# Altium schematic sheet arduino_nano.SchDoc
size 431 x 279 mm; SheetNumber: 2; SheetTotal: 4; ENG_APP_DATE: --/--/--; DSN_APP_DATE: --/--/--; CHK_APP_DATE: --/--/--
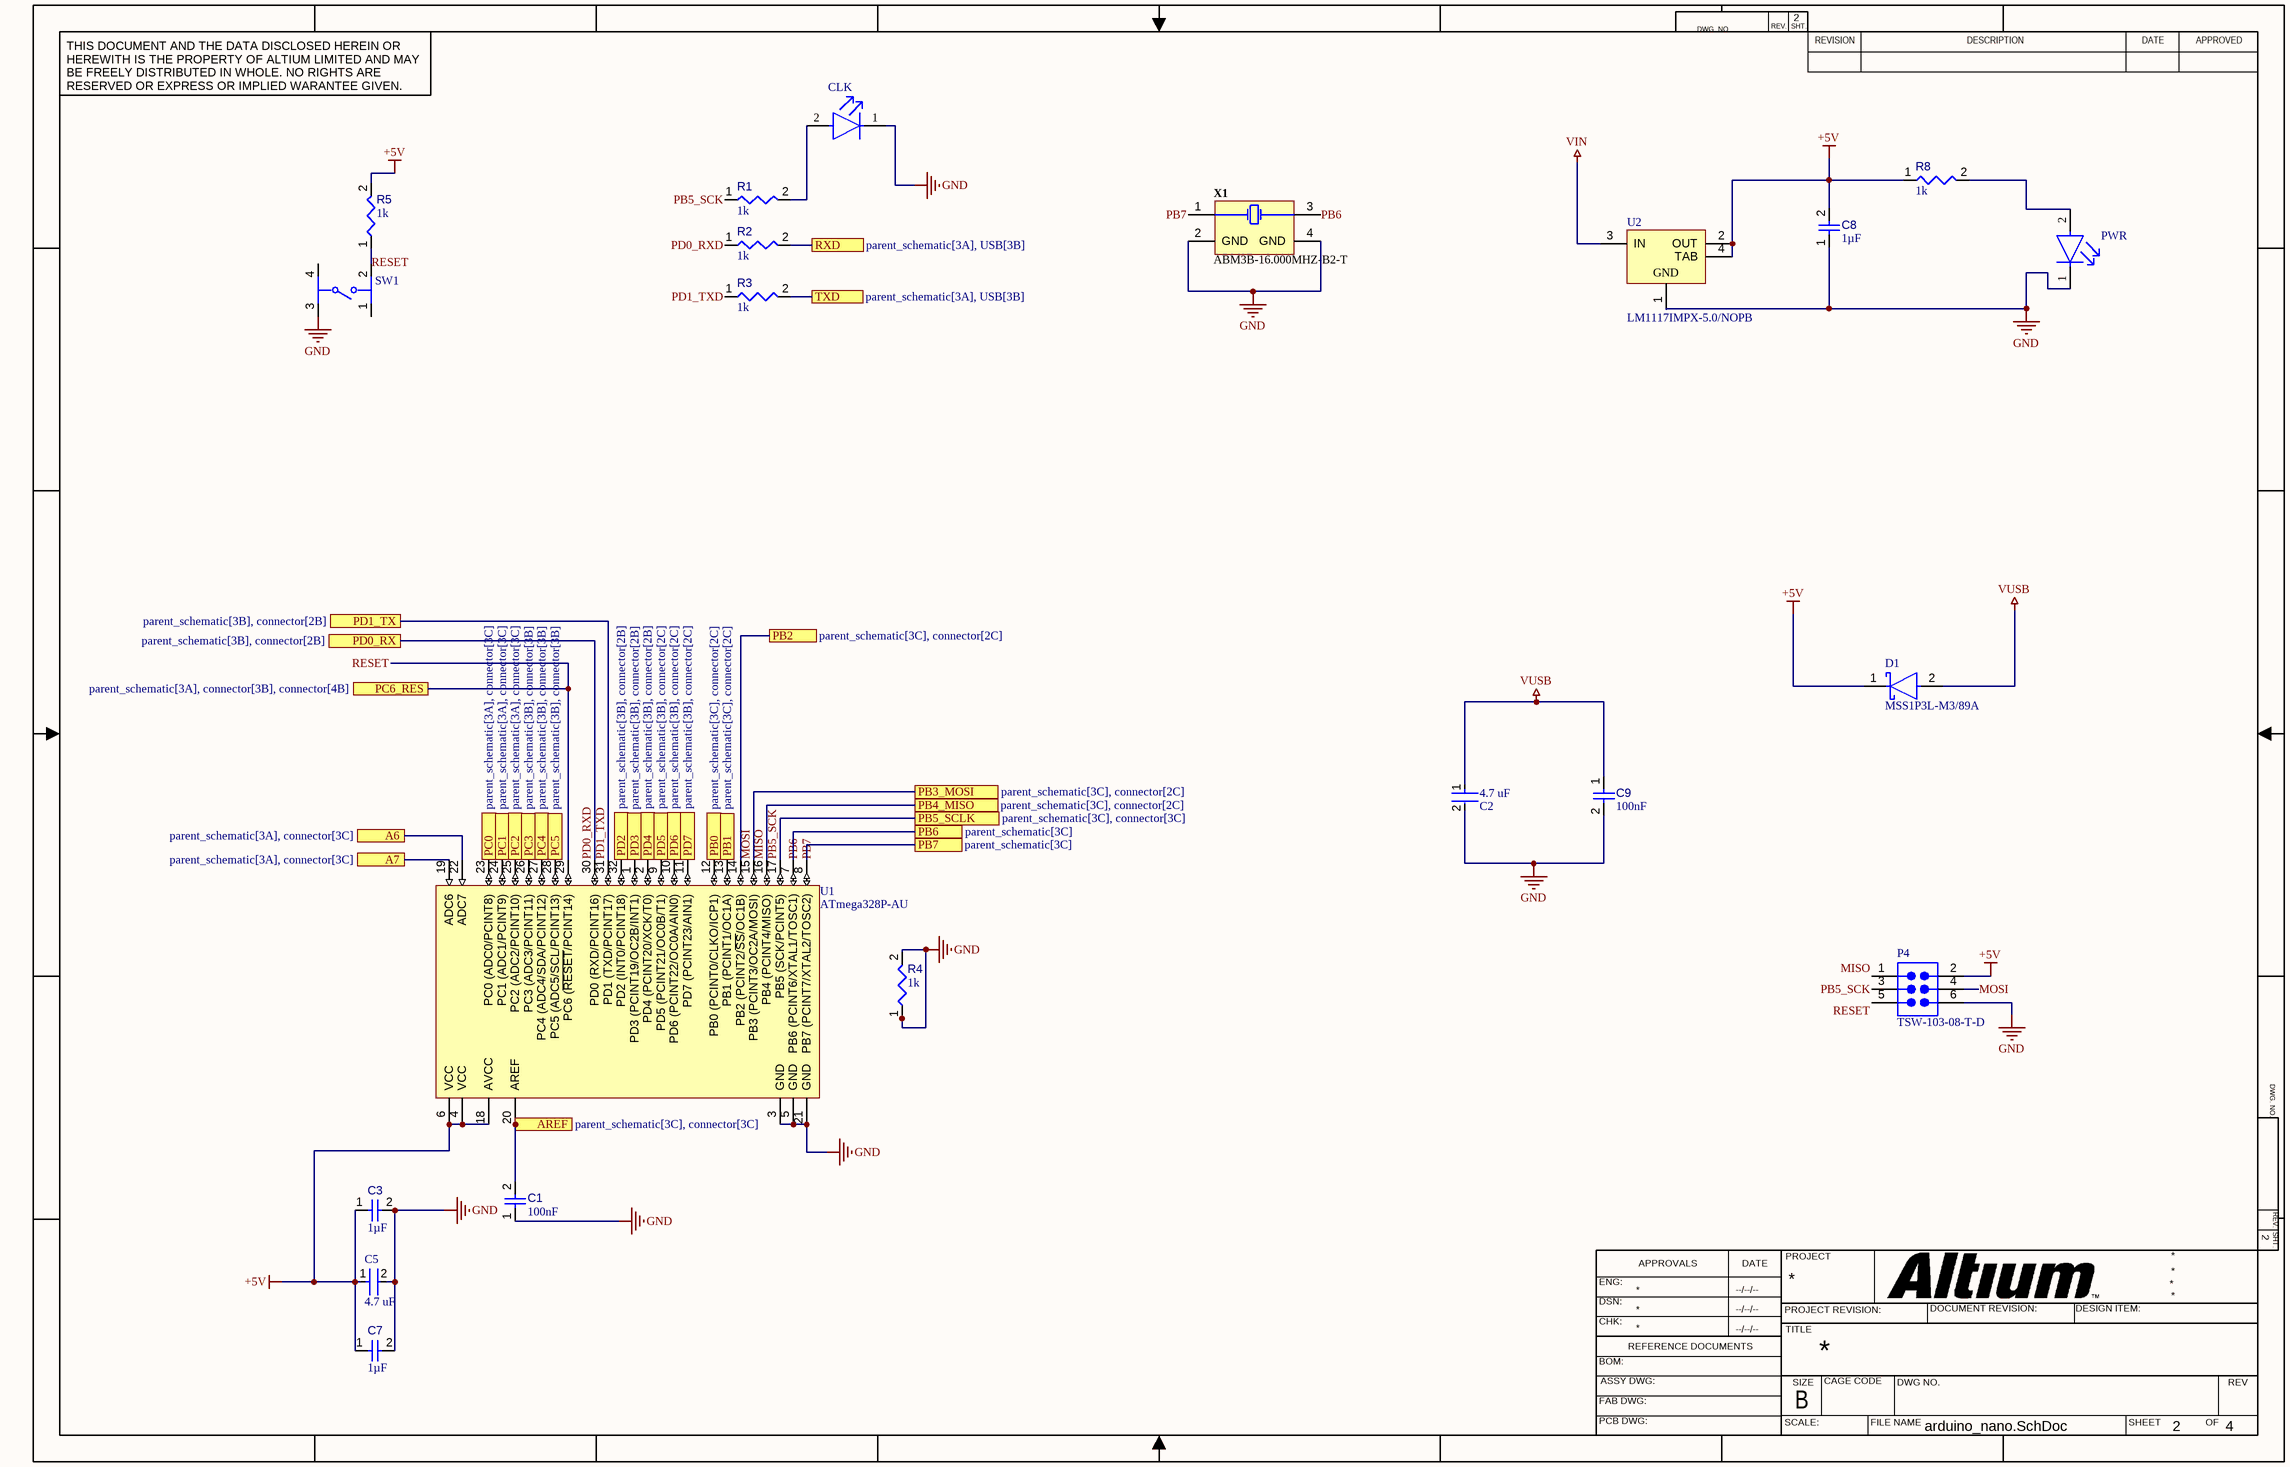
[diagram p0: arduino_nano.SchDoc]

## Parts
C1  value 100nF  [CAPC0402(1005)60_L]  (hidden comment: Capacitor 100nF +/-20% 25V 0402)
C2  4.7 uF  [FP-GRM21B-0_15-IPC_A]
C3  value 1µF  [CAPC1608X90X35ML15T15]  (hidden comment: Capacitor 1uF +/- 10% 16V 0603)
C5  4.7 uF  [FP-GRM21B-0_15-IPC_A]
C7  value 1µF  [CAPC1608X90X35ML15T15]  (hidden comment: Capacitor 1uF +/- 10% 16V 0603)
C8  value 1µF  [CAPC1608X90X35ML15T15]  (hidden comment: Capacitor 1uF +/- 10% 16V 0603)
C9  value 100nF  [CAPC0402(1005)60_L]  (hidden comment: Capacitor 100nF +/-20% 25V 0402)
CLK  (no value)  [FP-5973901831F-MFG]
D1  MSS1P3L-M3/89A  [FP-96591-MFG]
P4  TSW-103-08-T-D  [SMTC-TSW-103-08-X-D]
PWR  (no value)  [FP-5973901831F-MFG]
R1  value 1k  [RESC2012X70N]  (hidden comment: ERJP06J102V_with_model)
R2  value 1k  [RESC2012X70N]  (hidden comment: ERJP06J102V_with_model)
R3  value 1k  [RESC2012X70N]  (hidden comment: ERJP06J102V_with_model)
R4  value 1k  [RESC2012X70N]  (hidden comment: ERJP06J102V_with_model)
R5  value 1k  [RESC2012X70N]  (hidden comment: ERJP06J102V_with_model)
R8  value 1k  [RESC2012X70N]  (hidden comment: ERJP06J102V_with_model)
SW1  (no value)  [FP-PTS810SJM250SMTRLFS-MFG]
U1  ATmega328P-AU  [32A_M]
U2  LM1117IMPX-5.0/NOPB  [MP04A_M]
X1  ABM3B-16.000MHZ-B2-T  [ABRA-ABM3B-4_V]

## Ports
A6 (see parent_schematic[3A], connector[3C]), A7 (see parent_schematic[3A], connector[3C]), AREF (see parent_schematic[3C], connector[3C]), PB0 (see parent_schematic[3C], connector[2C]), PB1 (see parent_schematic[3C], connector[2C]), PB2 (see parent_schematic[3C], connector[2C]), PB3_MOSI (see parent_schematic[3C], connector[2C]), PB4_MISO (see parent_schematic[3C], connector[2C]), PB5_SCLK (see parent_schematic[3C], connector[3C]), PB6 (see parent_schematic[3C]), PB7 (see parent_schematic[3C]), PC0 (see parent_schematic[3A], connector[3C]), PC1 (see parent_schematic[3A], connector[3C]), PC2 (see parent_schematic[3A], connector[3C]), PC3 (see parent_schematic[3B], connector[3B]), PC4 (see parent_schematic[3B], connector[3B]), PC5 (see parent_schematic[3B], connector[3B]), PC6_RES (see parent_schematic[3A], connector[3B], connector[4B]), PD0_RX (see parent_schematic[3B], connector[2B]), PD1_TX (see parent_schematic[3B], connector[2B]), PD2 (see parent_schematic[3B], connector[2B]), PD3 (see parent_schematic[3B], connector[2B]), PD4 (see parent_schematic[3B], connector[2B]), PD5 (see parent_schematic[3B], connector[2C]), PD6 (see parent_schematic[3B], connector[2C]), PD7 (see parent_schematic[3B], connector[2C]), RXD (see parent_schematic[3A], USB[3B]), TXD (see parent_schematic[3A], USB[3B])

## Nets
+5V: C3.1 C5.1 C7.1 C8.2 D1.1(C) P4.2 R5.2 R8.1 U1.4(VCC) U1.6(VCC) U1.18(AVCC) U2.2(OUT) U2.4(TAB)
GND: C1.1 C2.2 C3.2 C5.2 C7.2 C8.1 C9.2 CLK.1(C) P4.6 PWR.1(C) R4.1 SW1.3 U1.3(GND) U1.5(GND) U1.21(GND) U2.1(GND) X1.2(GND) X1.4(GND)
VIN: U2.3(IN)
VUSB: C2.1 C9.1 D1.2(A)
A6: U1.22(ADC7) ; port A6
A7: U1.19(ADC6) ; port A7
AREF: C1.2 U1.20(AREF) ; port AREF
MISO: P4.1 U1.16(PB4_(PCINT4/MISO)) ; port PB4_MISO
MOSI: P4.4 U1.15(PB3_(PCINT3/OC2A/MOSI)) ; port PB3_MOSI
PB0: U1.12(PB0_(PCINT0/CLKO/ICP1)) ; port PB0
PB1: U1.13(PB1_(PCINT1/OC1A)) ; port PB1
PB2: U1.14(PB2_(PCINT2/~{SS}/OC1B)) ; port PB2
PB5_SCK: P4.3 R1.1 U1.17(PB5_(SCK/PCINT5)) ; port PB5_SCLK
PB6: U1.7(PB6_(PCINT6/XTAL1/TOSC1)) X1.3(X2) ; port PB6
PB7: U1.8(PB7_(PCINT7/XTAL2/TOSC2)) X1.1(X1) ; port PB7
PC0: U1.23(PC0_(ADC0/PCINT8)) ; port PC0
PC1: U1.24(PC1_(ADC1/PCINT9)) ; port PC1
PC2: U1.25(PC2_(ADC2/PCINT10)) ; port PC2
PC3: U1.26(PC3_(ADC3/PCINT11)) ; port PC3
PC4: U1.27(PC4_(ADC4/SDA/PCINT12)) ; port PC4
PC5: U1.28(PC5_(ADC5/SCL/PCINT13)) ; port PC5
PD0_RXD: R2.1 U1.30(PD0_(RXD/PCINT16)) ; port PD0_RX
PD1_TXD: R3.1 U1.31(PD1_(TXD/PCINT17)) ; port PD1_TX
PD2: U1.32(PD2_(INT0/PCINT18)) ; port PD2
PD3: U1.1(PD3_(PCINT19/OC2B/INT1)) ; port PD3
PD4: U1.2(PD4_(PCINT20/XCK/T0)) ; port PD4
PD5: U1.9(PD5_(PCINT21/OC0B/T1)) ; port PD5
PD6: U1.10(PD6_(PCINT22/OC0A/AIN0)) ; port PD6
PD7: U1.11(PD7_(PCINT23/AIN1)) ; port PD7
RESET: P4.5 R5.1 SW1.2 U1.29(PC6_(~{RESET}/PCINT14)) ; port PC6_RES
RXD: R2.2 ; port RXD
TXD: R3.2 ; port TXD
NetCLK_2: CLK.2(A) R1.2
NetPWR_2: PWR.2(A) R8.2

Not connected (* = marked no-connect by the designer): R4 2; SW1 1 4

## Notes on the sheet
- DWG. NO.
- REV.
- SHT.
- THIS DOCUMENT AND THE DATA DISCLOSED HEREIN OR HEREWITH IS THE PROPERTY OF ALTIUM LIMITED AND MAY BE FREELY DISTRIBUTED IN WHOLE. NO RIGHTS ARE RESERVED OR EXPRESS OR IMPLIED WARANTEE GIVEN.
- REVISION
- DESCRIPTION
- DATE
- APPROVED
- ENG:
- APPROVALS
- PROJECT
- DSN:
- CHK:
- REFERENCE DOCUMENTS
- PROJECT REVISION:
- TITLE
- DOCUMENT REVISION:
- DESIGN ITEM:
- BOM:
- FAB DWG:
- PCB DWG:
- ASSY DWG:
- SCALE:
- SIZE
- B
- CAGE CODE
- FILE NAME
- DWG NO.
- SHEET
- OF
- REV

## Library data of the parts
C1 C9 = CMP-001-00065-4: Chip Capacitor, 100nF +/-20%, 25V, 0402, Thickness 0.6 mm; Tolerance: 10%; Max Operating Temperature: 85°C; Min Operating Temperature: -55°C; Pins: 2; Voltage Rating: 25V; Mounting Technology: SMT; Case/Package: 0402
C2 C5 = CMP-06035-033280-1: Chip Multilayer Ceramic Capacitors for General Purpose, 0805, 4.7uF, X6S, 22%, 20%, 35V; Length: 2mm; Dielectric: X6S; Width: 1.25mm; Capacitance: 4.7uF; Case/Package: 0805; Tolerance: 20%; Voltage Rating (DC): 35V; Thickness: 1.25mm
C3 C7 C8 = CMP-001-00004-6: Chip Capacitor, 1 uF, +/- 10%, 16 V, 0603 (1608 Metric); Capacitor Type: Ceramic; Mounting Technology: SM; RoHS Compliant: True; Min Operating Temperature: -55°C; Case/Package: 0603; Pins: 2; Voltage Rating: 16V; Max Operating Temperature: 125°C; Tolerance: 10%
CLK PWR = CMP-15384-000002-3: LED COOL WHITE 2SMD; NexarPartId: 10598902; Power Dissipation: 70mW; Lens Style: Diffused, Rectangular, Tinted; Lens Color: Yellow; Forward Current: 10mA; Viewing Angle: 130°; Reverse Voltage: 5V; Forward Voltage: 3.4V; Luminous Intensity: 240mcd; Packaging: Cut Tape; Width: 800µm; RoHS: Compliant; Min Operating Temperature: -20°C; Length: 1.6mm; Height: 550µm; Color: White; Power Rating: 70mW; Case Code (Imperial): 0603; Max Operating Temperature: 80°C; Case/Package: 0603; Mount: Surface Mount; REACH SVHC: No SVHC; Case Code (Metric): 1608; Test Current: 10mA; Illumination Color: White
D1 = CMP-02539-000006-1: DIODE SCHOTTKY 30V 1A MICROSMP; Manufacturer: Vishay; Max Junction Temp: +150°C; Max Surge Forward Current: 25A; Value: 65pF; Peak Reverse Current: 15uA; Max Repetitive Reverse Voltage: 30V; Mouser Description: Schottky Diodes & Rectifiers 1.0 Amp 30 Volt; Device Class L2: Diodes; RoHS: TRUE; Temperature Range Low: -55°C; ComponentLink2URL: http://www.vishay.com/docs/89020/mss1p3l.pdf; Octopart: https://octopart.com/mss1p3l-m3%2F89a-vishay-42670898; Automotive: No; Height: 0.73mm; Temperature: -55°C to +150°C; Temperature Range High: +150°C; ComponentLink2Description: Datasheet; Lead Free: Yes; Digikey Description: DIODE SCHOTTKY 30V 1A MICROSMP; Forward Current: 1A; Manufacturer Part Number: MSS1P3L-M3/89A; Footprint Url: http://www.vishay.com/docs/96591/microsmp_do-219ad_fredpt.pdf; Device Class L1: Discrete Semiconductors; Capacitance: 65pF; Device Class L3: Schottky Diodes; Package: 96591; Category: Diode
P4 = CMP-1024-00335-1: 0.025" SQ Post Header, Through-hole, Vertical, -55 to 105 degC, 2.54 mm Pitch, 6-Pin, Male, RoHS; Manufacturer: Samtec; Pitch: 2.54 mm; PackageDescription: .025[0.64] SQ. Post Terminal Strip Assembly; DatasheetVersion: F-214; ComponentLink3Description: Package Specification; Mounting Technology: Through-hole; ComponentLink1URL: http://www.samtec.com; ComponentLink2URL: http://www.samtec.com/documents/webfiles/pdf/TSW_TH.PDF; PartNumber: TSW-103-08-T-D; ComponentLink1Description: Manufacturer URL; Temperature Range: -55 to 105 degC; ComponentLink2Description: Datasheet; PackageVersion: DM, 8/1988; RoHS: True; ComponentLink3URL: http://www.samtec.com/documents/webfiles/cpdf/TSW-XXX-XX-XXX-X-XX-XXX-MKT.pdf; Orientation: Vertical; PackageReference: TSW-103-08-X-D
R1-R5 R8 = CMP-009-00186-3: Res Thick Film 0805 1K Ohm 5% 0.5W(1/2W) ±200ppm/C Pad SMD Automotive T/R; Voltage Rating: 400V; Max Operating Temperature: 155°C; Tolerance: 5%; Case/Package: 0805; Min Operating Temperature: -55°C; Mounting Technology: Surface Mount
SW1 = CMP-10040-000001-2: SWITCH TACTILE SPST-NO 0.05A 16V; Throw Configuration: SPST; Operating Force: 160gf; Actuator Type: Standard; Switch Travel: 0.15mm; Switch Function: Off-Mom; Max Current Rating: 50mA; Mechanical Life: 150000Cycles; Illumination Type: Non-Illuminated; Package Quantity: 2900; Depth: 4.6mm; Mount: Surface Mount; Packaging: Tape and Reel; Length: 3.2mm; RoHS Compliant: Yes; Case/Package: SMD/SMT; Voltage Rating (DC): 16V; Min Operating Temperature: -40°C; Termination: J-Bend; Lead Free: Lead Free; Contact Plating: Silver; Orientation: Straight; Max Operating Temperature: 85°C; Current Rating: 50mA; Color: Black
U1 = CMP-0095-00269-2: 8-bit AVR Microcontroller, 32KB Flash, 1KB EEPROM, 2KB SRAM, 32-pin TQFP, Industrial Grade (-40°C to 85°C); PackageDescription: 32-Lead, 7x7x1.0 mm Body, 0.8mm Lead Pitch, Thin Profile Plastic Quad Flat Package (TQFP); DatasheetVersion: revD, May-2011; RevisionNote: DatasheetVersion & PackageVersion updated. URLs added.; ComponentLink1URL: http://www.atmel.com/; ComponentLink2Description: ATmega48A/48PA/88A/88PA/168A/168PA/328/328P Datasheet; Code_JEDEC: MS-026-ABA; ComponentLink1Description: Manufacturer URL; PackageReference: 32A; ComponentLink3Description: ATmega48A/48PA/88A/88PA/168A/168PA/328/328P Summary; ComponentLink2URL: http://www.atmel.com/dyn/resources/prod_documents/doc8271.pdf; PackageVersion: revC, Oct-2010; ComponentLink3URL: http://www.atmel.com/dyn/resources/prod_documents/8271S.pdf
U2 = CMP-0062-01628-3: 800mA Low-Dropout Linear Regulator, 4-pin SOT-223, Pb-Free; Manufacturer: National Semiconductor; CompType: LDO IC; High-Reliability: Y; PackageTopMarking: XYTT*N06B; PowerWise: N; ComponentLink3Description: LM1117 Web Page; ComponentLink3URL: http://www.national.com/pf/LM/LM1117.html; DatasheetVersion: Apr-2006; ComponentLink2Description: LM1117 Datasheet; PackageVersion: revB, Apr-2003; ComponentLink4Description: MP04A Package Page; ComponentLink1Description: Manufacturer URL; PartNumber: LM1117IMPX-5.0/NOPB; ComponentLink1URL: http://www.national.com/; PackageReference: MP04A; ComponentLink2URL: http://www.national.com/ds/LM/LM1117.pdf; PinCount: 4; Code_JEDEC: TO-261-AA; RevisionNote: SCH symbol layout adjusted; ComponentLink4URL: http://www.national.com/packaging/folders/mp04a.html; RoHS: Y; Code_IPC: SOT223-4; PackageDescription: Molded SOT-223, 6.50 x 3.56 x 1.6mm Body, 4 Lead, 2.3mm Pitch
X1 = CMP-003-00017-2: Ceramic SMD Crystal, 16 MHz, +/- 20 ppm, 18 pF, -20 to 70 degC, 4-Pin SMD, RoHS, Tape and Reel; Manufacturer: Abracon; Tolerance: 20ppm; Load Capacitance: 18pF; Frequency: 16MHz; Resistance: 50Ohm; ESR: 50; Max Operating Temperature: 70°C; Frequency Tolerance: 20ppm; Min Operating Temperature: -20°C; Packaging: TapeandReel; Manufacturer URL: http://www.abracon.com/; Package Quantity: 1000; Datasheet URL: http://www.abracon.com/Resonators/abm3b.pdf; Package Description: 4-Pin Surface Mount Device, Body 5 x 3.2 mm; Pins: 4; Package Reference: ABM3B; Datasheet Version: Aug-15; Case/Package: CSMD; Mounting Technology: SM; RoHS Compliant: True